# EAGLE design l-drv_h2-smd-001 (EAGLE 7.2.0)
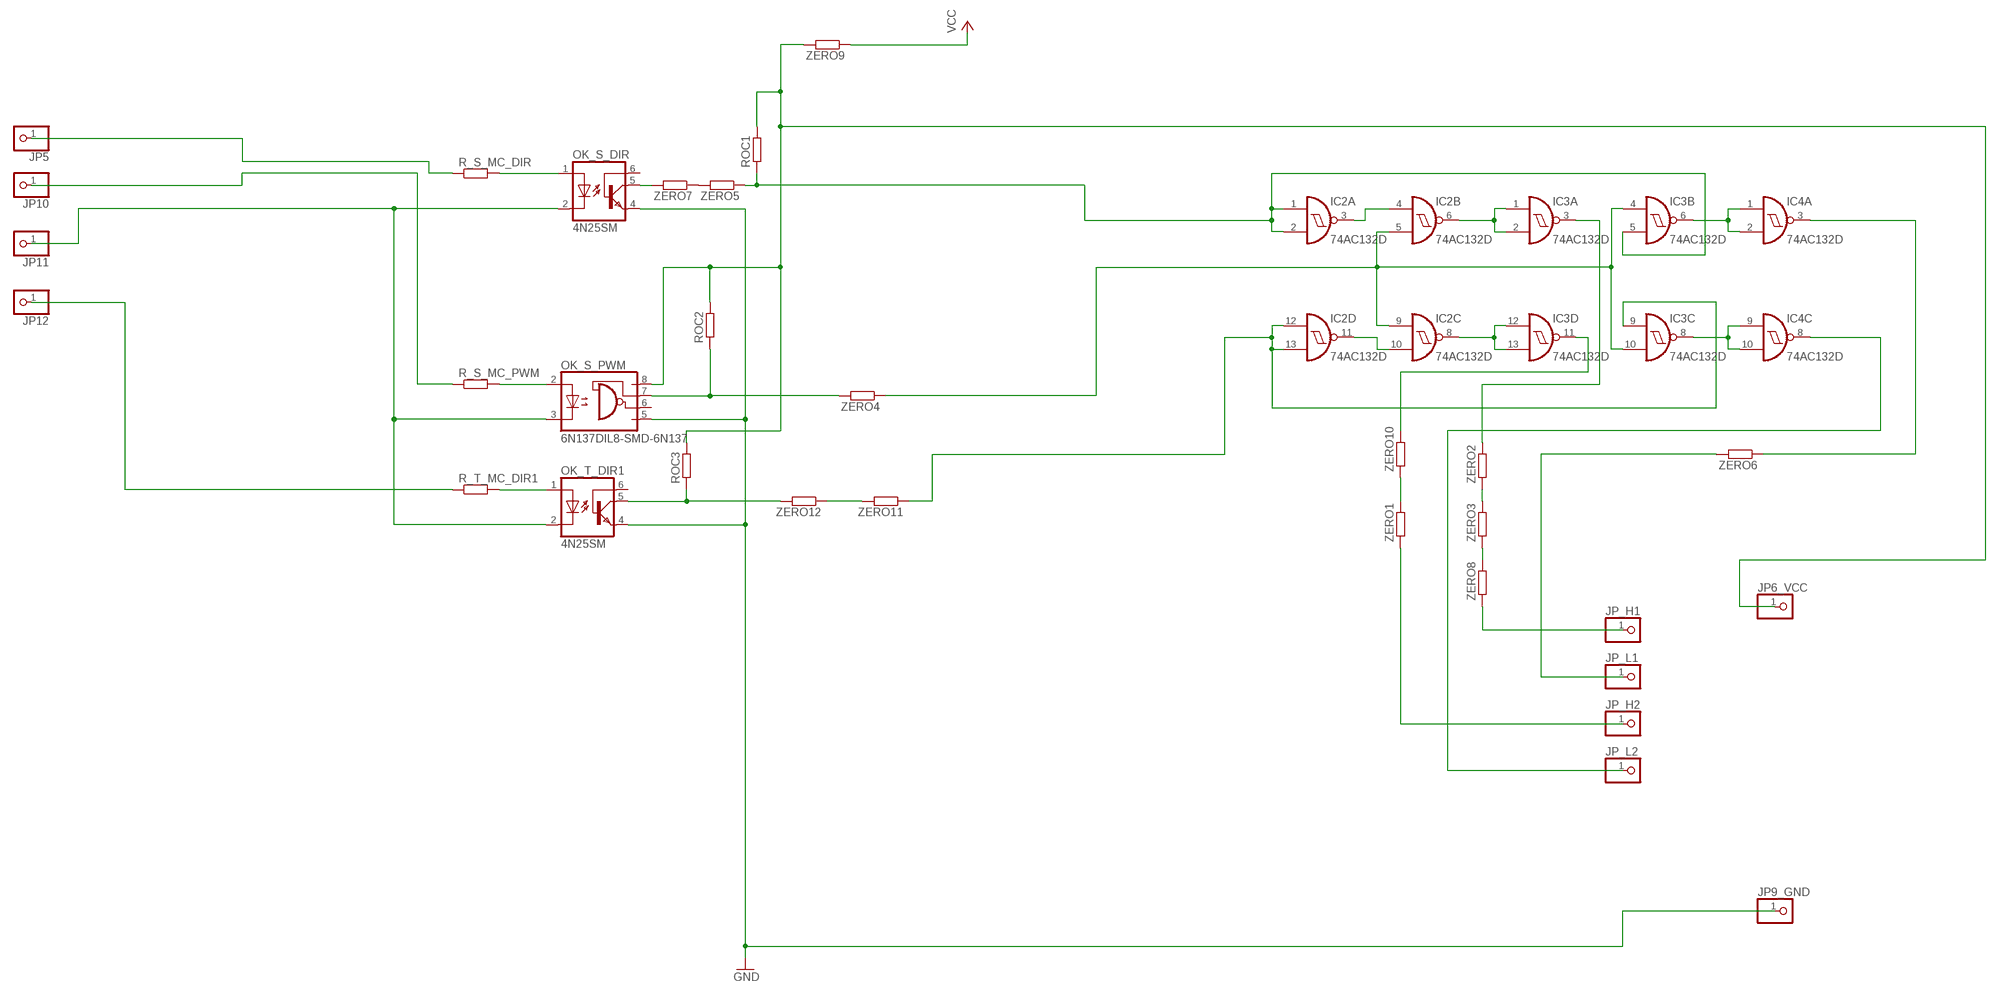
[diagram p0: schematic, sheet 1]

## Parts
IC2  74AC132D  [SO14]
IC3  74AC132D  [SO14]
IC4  74AC132D  [SO14]
JP5  PINHD-1X1  [1X01]
JP6_VCC  PINHD-1X1  [1X01]
JP9_GND  PINHD-1X1  [1X01]
JP10  PINHD-1X1  [1X01]
JP11  PINHD-1X1  [1X01]
JP12  PINHD-1X1  [1X01]
JP_H1  PINHD-1X1  [1X01]
JP_H2  PINHD-1X1  [1X01]
JP_L1  PINHD-1X1  [1X01]
JP_L2  PINHD-1X1  [1X01]
OK_S_DIR  4N25SM  [DIL6-SMD]
OK_S_PWM  6N137DIL8-SMD-6N137  [DIL8-SMD]
OK_T_DIR1  4N25SM  [DIL6-SMD]
R_S_MC_DIR  R-EU_R1206  [R1206]
R_S_MC_PWM  R-EU_R1206  [R1206]
R_T_MC_DIR1  R-EU_R1206  [R1206]
ROC1  R-EU_R1206  [R1206]
ROC2  R-EU_R1206  [R1206]
ROC3  R-EU_R1206  [R1206]
ZERO1  R-EU_R1206  [R1206]
ZERO2  R-EU_R1206  [R1206]
ZERO3  R-EU_R1206  [R1206]
ZERO4  R-EU_R1206  [R1206]
ZERO5  R-EU_R1206  [R1206]
ZERO6  R-EU_R1206  [R1206]
ZERO7  R-EU_R1206  [R1206]
ZERO8  R-EU_R1206  [R1206]
ZERO9  R-EU_R1206  [R1206]
ZERO10  R-EU_R1206  [R1206]
ZERO11  R-EU_R1206  [R1206]
ZERO12  R-EU_R1206  [R1206]

## Nets
GND: JP9_GND.1 OK_S_DIR.4(EMI) OK_S_PWM.5(GND) OK_T_DIR1.4(EMI)
MC_GND: JP11.1 OK_S_DIR.2(C) OK_S_PWM.3(C) OK_T_DIR1.2(C)
N$1: OK_S_DIR.1(A) R_S_MC_DIR.2
N$2: OK_S_PWM.2(A) R_S_MC_PWM.2
N$3: OK_T_DIR1.1(A) R_T_MC_DIR1.2
N$4: IC3.3(A:O) ZERO2.2
N$5: IC2.3(A:O) IC2.4(B:I0)
N$6: JP5.1 R_S_MC_DIR.1
N$7: JP10.1 R_S_MC_PWM.1
N$8: JP12.1 R_T_MC_DIR1.1
N$9: IC2.10(C:I1) IC2.11(D:O)
N$10: ZERO1.2 ZERO10.1
N$11: IC2.6(B:O) IC3.1(A:I0) IC3.2(A:I1)
N$12: IC2.8(C:O) IC3.12(D:I0) IC3.13(D:I1)
N$13: JP_H2.1 ZERO1.1
N$14: JP_H1.1 ZERO8.1
N$15: IC3.11(D:O) ZERO10.2
N$16: ZERO2.1 ZERO3.2
N$17: IC4.3(A:O) ZERO6.1
N$18: IC4.8(C:O) JP_L2.1
N$19: IC3.6(B:O) IC4.1(A:I0) IC4.2(A:I1)
N$20: OK_S_PWM.7(VE) ROC2.1 ZERO4.2
N$21: IC3.8(C:O) IC4.9(C:I0) IC4.10(C:I1)
N$22: ZERO5.2 ZERO7.1
N$23: JP_L1.1 ZERO6.2
N$24: OK_S_DIR.5(COL) ZERO7.2
N$25: ZERO3.1 ZERO8.2
N$26: JP6_VCC.1 OK_S_PWM.8(VCC) ROC1.2 ROC2.2 ROC3.2 ZERO9.2
N$27: OK_T_DIR1.5(COL) ROC3.1 ZERO12.2
N$28: ZERO11.2 ZERO12.1
N$D1: IC2.1(A:I0) IC2.2(A:I1) IC3.5(B:I1) ROC1.1 ZERO5.1
N$D2: IC2.12(D:I0) IC2.13(D:I1) IC3.9(C:I0) ZERO11.1
N$PWM: IC2.5(B:I1) IC2.9(C:I0) IC3.4(B:I0) IC3.10(C:I1) ZERO4.1
VCC: ZERO9.1
Unconnected: IC4.4(B:I0) IC4.5(B:I1) IC4.6(B:O) IC4.11(D:O) IC4.12(D:I0) IC4.13(D:I1) OK_S_DIR.6(BAS) OK_S_PWM.6(VO) OK_T_DIR1.6(BAS)

## Power pins joined to a net without a drawn wire
GND: IC2.7(P:GND) IC3.7(P:GND) IC4.7(P:GND)
VCC: IC2.14(P:VCC) IC3.14(P:VCC) IC4.14(P:VCC)

## Library data of the parts
IC2-IC4 = 74xx-eu:74*132: Quad 2-input NAND schmitt trigger
JP5 JP6_VCC JP9_GND JP10-JP12 JP_H1 JP_H2 JP_L1 JP_L2 = pinhead:PINHD-1X1: PIN HEADER
OK_S_DIR OK_T_DIR1 = optocoupler:4N*?M: General Purpose 6-Pin Phototransistor Optocouplers Source: http://www.fairchildsemi.com/ds/4N/4N35-M.pdf; MF: FAIRCHILD SEMICONDUCTOR; MPN: 4N25SM; OC_FARNELL: 1021152; OC_NEWARK: 34C2020
OK_S_PWM = dbg-misc:6N137: MOTOROLA OPTO COUPLER
R_S_MC_DIR R_S_MC_PWM R_T_MC_DIR1 ROC1-ROC3 ZERO1-ZERO12 = rcl:R-EU_: RESISTOR, European symbol

## Board
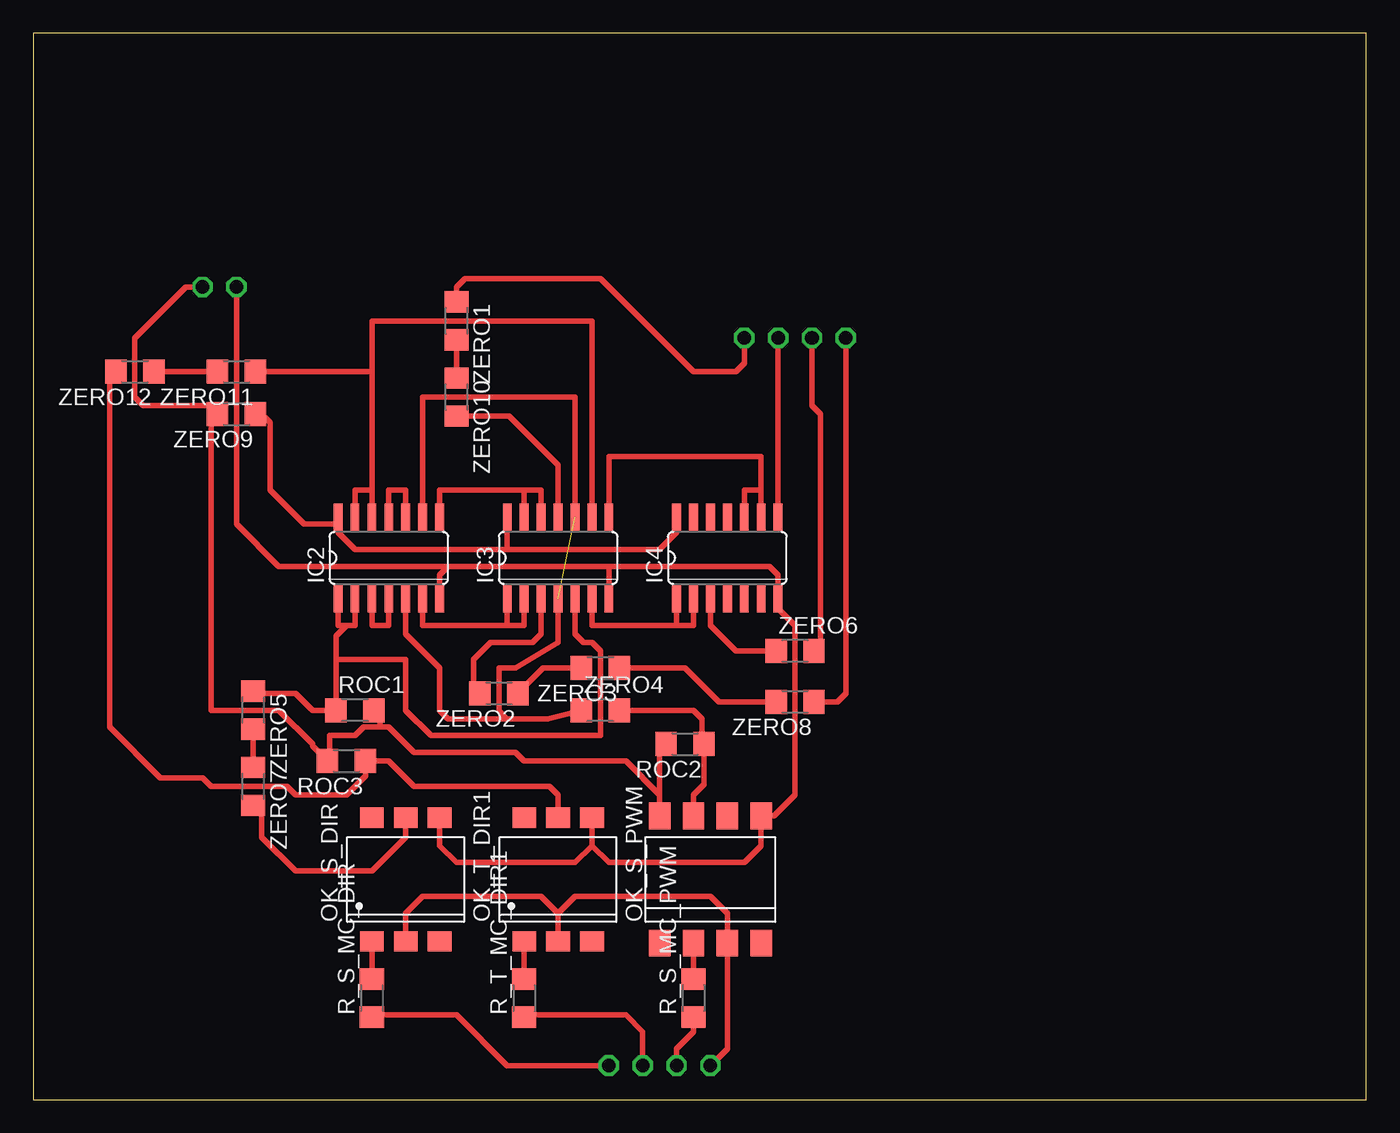
[diagram p1: board, top side]
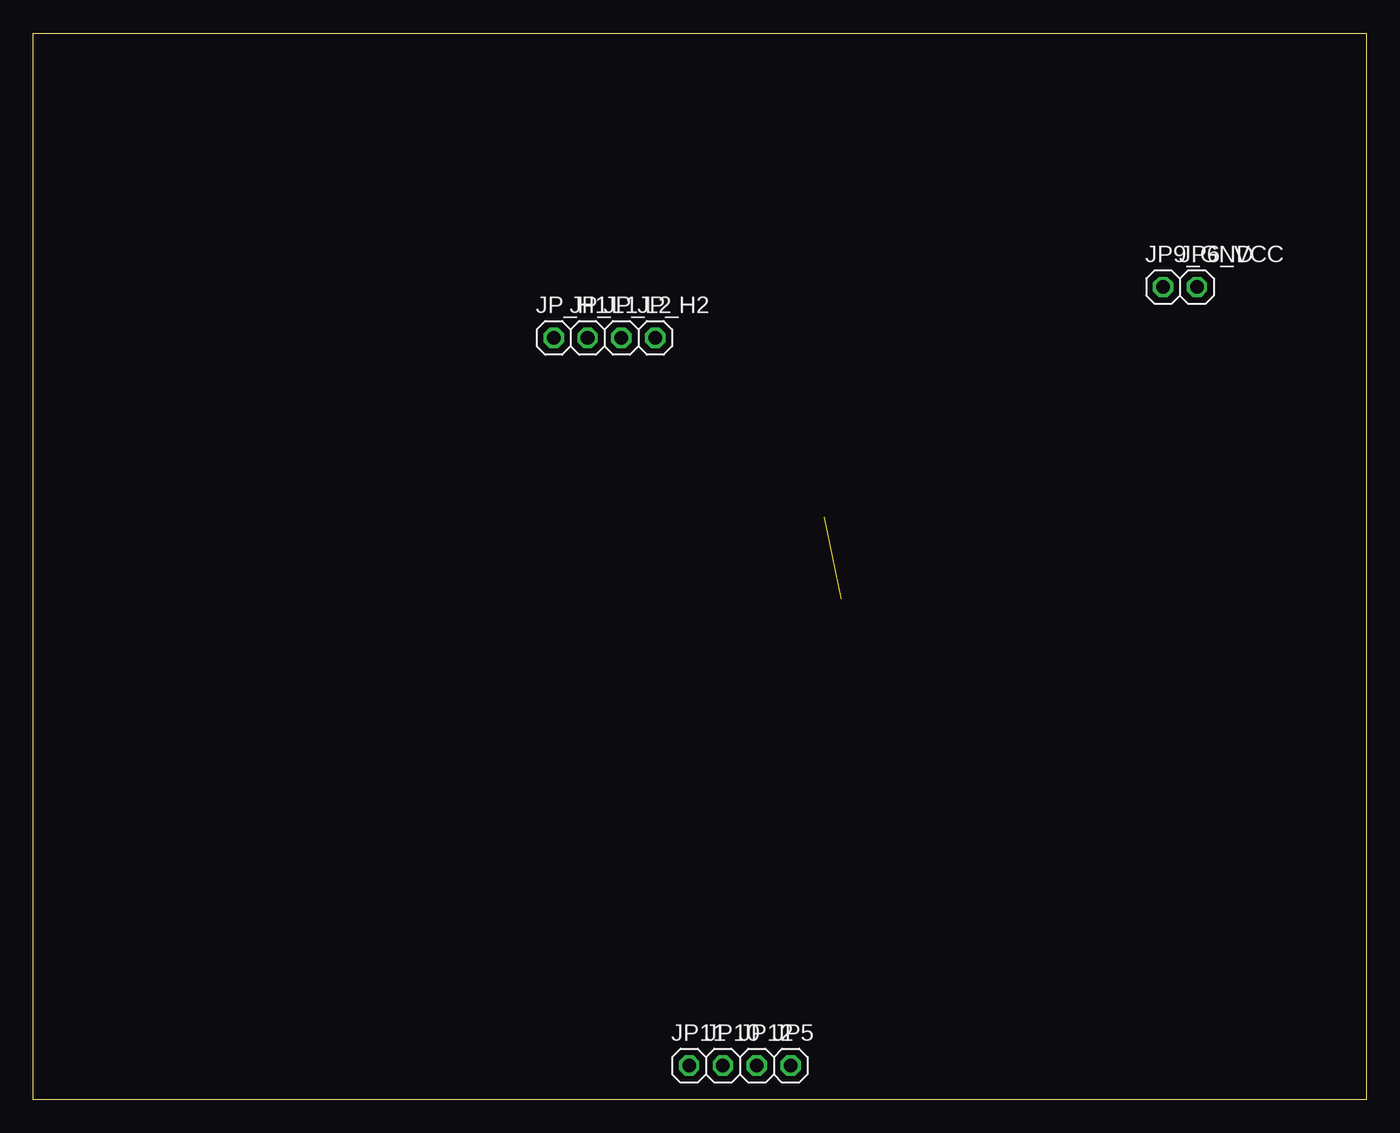
[diagram p2: board, bottom side, seen from below]

Size 100 x 80 mm. Coordinates in mm from the lower left corner, seen from the top.
Outline: 0,0 100,0 100,80 0,80 0,0
Copper layers (1*16): Top 0.035mm / dielectric 1.5mm / Bottom 0.035mm
Design rules "default": minimum track width 10mil, minimum drill 24mil, track to track 8mil, track to pad 8mil, pad to pad 8mil, via to via 8mil, smd to smd 8mil, copper to edge 40mil, drill to drill 8mil, minimum pad ring 10mil, minimum via ring 8mil, stop-mask expansion 4mil, vias tented up to drill 0mil, thermal gap 10mil

### Footprints (pad centres in the part's own frame; a part is rotated, then mirrored left to right if it is on the bottom)
SO14 = smd 0.66 x 2.032: 1 -3.81,-3.073; 2 -2.54,-3.073; 3 -1.27,-3.073; 4 0,-3.073; 5 1.27,-3.073; 6 2.54,-3.073; 7 3.81,-3.073; 8 3.81,3.073; 9 2.54,3.073; 10 1.27,3.073; 11 0,3.073; 12 -1.27,3.073; 13 -2.54,3.073; 14 -3.81,3.073
1X01 = drill 1.016 octagon: 1 0,0
DIL6-SMD = smd 1.78 x 1.52: 1 -2.54,-4.645; 2 0,-4.645; 3 2.54,-4.645; 4 2.54,4.645; 5 0,4.645; 6 -2.54,4.645
DIL8-SMD = smd 1.6 x 2: 1 -3.81,-4.77; 2 -1.27,-4.77; 3 1.27,-4.77; 4 3.81,-4.77; 5 3.81,4.77; 6 1.27,4.77; 7 -1.27,4.77; 8 -3.81,4.77
R1206 = smd 1.6 x 1.803: 1 -1.422,0; 2 1.422,0

### Placement (x,y rotation side)
IC2  26.67,40.64 0 top
IC3  39.37,40.64 0 top
IC4  52.07,40.64 0 top
JP5  43.18,2.54 0 bottom
JP6_VCC  12.7,60.96 0 bottom
JP9_GND  15.24,60.96 0 bottom
JP10  48.26,2.54 0 bottom
JP11  50.8,2.54 0 bottom
JP12  45.72,2.54 0 bottom
JP_H1  60.96,57.15 0 bottom
JP_H2  53.34,57.15 0 bottom
JP_L1  58.42,57.15 0 bottom
JP_L2  55.88,57.15 0 bottom
OK_S_DIR  27.94,16.51 0 top
OK_S_PWM  50.8,16.51 0 top
OK_T_DIR1  39.37,16.51 0 top
R_S_MC_DIR  25.4,7.62 90 top
R_S_MC_PWM  49.53,7.62 90 top
R_T_MC_DIR1  36.83,7.62 90 top
ROC1  24.13,29.21 0 top
ROC2  48.9,26.67 180 top
ROC3  23.5,25.4 180 top
ZERO1  31.75,58.42 270 top
ZERO2  34.92,30.48 180 top
ZERO3  42.55,32.38 180 top
ZERO4  42.55,29.21 0 top
ZERO5  16.51,29.21 270 top
ZERO6  57.15,33.66 0 top
ZERO7  16.51,23.5 270 top
ZERO8  57.15,29.84 180 top
ZERO9  15.24,51.44 180 top
ZERO10  31.75,52.7 270 top
ZERO11  15.24,54.61 180 top
ZERO12  7.62,54.61 180 top

### Tracks (layer width: path | path; a pad name or v marks a point on that pad's centre or on a via)
GND
  Top 0.406: OK_S_DIR.4 30.48,19.05 31.75,17.78 40.64,17.78 41.91,19.05 | OK_T_DIR1.4 41.91,19.05 | 41.91,19.05 43.18,17.78 53.34,17.78 54.61,19.05 OK_S_PWM.5 55.57,21.28 57.15,22.86 57.15,35.56 55.88,36.83 IC4.7 55.88,39.37 55.24,40.01 43.18,40.01 | IC2.7 30.48,39.37 31.11,40.01 | 31.11,40.01 43.18,40.01 | IC3.7 43.18,40.01 | JP9_GND.1 15.24,43.18 18.41,40.01 31.11,40.01
MC_GND
  Top 0.406: 39.37,13.97 40.64,15.24 50.8,15.24 52.07,13.97 OK_S_PWM.3 52.07,3.81 JP11.1 | OK_T_DIR1.2 39.37,13.97 | 39.37,13.97 38.1,15.24 29.21,15.24 27.94,13.97 OK_S_DIR.2
N$1
  Top 0.406: OK_S_DIR.1 R_S_MC_DIR.2
N$2
  Top 0.406: OK_S_PWM.2 R_S_MC_PWM.2
N$3
  Top 0.406: OK_T_DIR1.1 R_T_MC_DIR1.2
N$4
  Top 0.406: IC3.3 38.1,34.92 37.47,34.29 34.29,34.29 33.02,33.02 33.02,30.96 ZERO2.2
N$5
  Top 0.406: IC2.3 25.4,35.56 26.67,35.56 IC2.4
N$6
  Top 0.406: JP5.1 35.56,2.54 31.75,6.35 25.55,6.35 R_S_MC_DIR.1
N$7
  Top 0.406: R_S_MC_PWM.1 49.53,5.08 48.26,3.81 JP10.1
N$8
  Top 0.406: JP12.1 45.72,5.08 44.45,6.35 36.98,6.35 R_T_MC_DIR1.1
N$9
  Top 0.406: IC2.10 27.94,45.72 26.67,45.72 IC2.11
N$10
  Top 0.406: ZERO1.2 ZERO10.1
N$11
  Top 0.406: IC2.6 29.21,35.56 35.56,35.56 | 35.56,35.56 36.83,35.56 IC3.2 | IC3.1 35.56,35.56
N$12
  Top 0.406: IC3.13 36.83,45.72 | 36.83,45.72 38.1,45.72 IC3.12 | IC2.8 30.48,45.72 36.83,45.72
N$13
  Top 0.406: ZERO1.1 31.75,60.96 32.38,61.59 42.55,61.59 49.53,54.61 52.7,54.61 53.34,55.24 JP_H2.1
N$14
  Top 0.406: JP_H1.1 60.96,30.48 60.33,29.84 ZERO8.1
N$15
  Top 0.406: ZERO10.2 35.71,51.28 39.37,47.62 IC3.11
N$16
  Top 0.406: ZERO3.2 38.25,32.38 ZERO2.1
N$17
  Top 0.406: IC4.3 50.8,35.56 52.7,33.66 ZERO6.1
N$18
  Top 0.406: JP_L2.1 IC4.8
N$19
  Top 0.406: IC3.6 41.91,35.56 48.26,35.56 | 48.26,35.56 IC4.1 | IC4.2 49.53,35.56 48.26,35.56
N$20
  Top 0.406: OK_S_PWM.7 49.53,22.86 50.32,23.65 ROC2.1 50.32,27.15 50.16,27.3 50.16,28.57 49.53,29.21 ZERO4.2
N$21
  Top 0.406: IC3.8 43.18,48.26 54.61,48.26 54.61,45.72 | 54.61,45.72 IC4.9 | IC4.10 53.34,45.72 54.61,45.72
N$22
  Top 0.406: ZERO7.1 ZERO5.2
N$23
  Top 0.406: ZERO6.2 59.05,34.14 59.05,51.44 58.42,52.07 JP_L1.1
N$24
  Top 0.406: OK_S_DIR.5 27.94,19.68 25.4,17.14 19.68,17.14 17.14,19.68 17.14,21.44 ZERO7.2
N$25
  Top 0.406: ZERO3.1 48.9,32.38 51.44,29.84 ZERO8.2
N$26
  Top 0.406: ROC2.2 46.99,26.19 OK_S_PWM.8 46.99,22.86 44.45,25.4 36.83,25.4 36.2,26.04 28.57,26.04 26.67,27.94 26.04,27.94 | 26.04,27.94 26.04,28.73 ROC1.2 | JP6_VCC.1 11.43,60.96 7.62,57.15 7.62,52.7 8.26,52.07 13.18,52.07 ZERO9.2 13.34,50.95 13.34,29.21 18.41,29.21 20.95,26.67 20.95,26.52 ROC3.2 22.23,25.55 22.23,27.3 24.13,27.3 24.77,27.94 26.04,27.94
N$27
  Top 0.406: OK_T_DIR1.5 39.37,22.86 38.73,23.5 28.57,23.5 26.67,25.4 ROC3.1 24.92,24.28 23.5,22.86 19.68,22.86 19.05,23.5 13.34,23.5 12.7,24.13 9.53,24.13 5.71,27.94 5.71,54.13 ZERO12.2
N$28
  Top 0.406: ZERO12.1 ZERO11.2
N$D1
  Top 0.406: IC2.1 22.86,35.56 23.5,35.56 | 23.5,35.56 24.13,35.56 IC2.2 | ROC1.1 22.71,33.02 | 22.71,33.02 22.71,34.77 23.5,35.56 | ROC1.1 22.71,28.73 | 22.71,33.02 27.94,33.02 27.94,29.21 29.84,27.3 42.55,27.3 42.55,33.66 41.91,34.29 41.27,34.29 40.64,34.92 IC3.5 | 22.86,29.06 ROC1.1 | ROC1.1 20.95,29.21 19.68,30.48 16.66,30.48 ZERO5.1
N$D2
  Top 0.406: IC2.13 24.13,45.72 25.4,45.72 | 25.4,45.72 IC2.12 | IC3.9 41.91,58.42 25.4,58.42 25.4,54.61 | 25.4,54.61 25.4,45.72 | ZERO11.1 25.4,54.61
N$PWM  (1 unrouted)
  Top 0.406: IC2.9 29.21,52.7 40.64,52.7 IC3.10 | IC3.4 39.37,34.29 36.2,32.38 34.92,32.38 34.92,29.21 35.56,28.57 | 35.56,28.57 38.58,28.57 ZERO4.1 | IC2.5 27.94,34.92 30.48,32.38 30.48,29.21 31.11,28.57 35.56,28.57
VCC
  Top 0.406: IC2.14 22.86,43.18 | 22.86,43.18 22.86,42.55 24.13,41.27 35.56,41.27 | 35.56,41.27 IC3.14 | 35.56,41.27 46.99,41.27 48.26,42.55 IC4.14 | 22.86,43.18 20.32,43.18 17.78,45.72 17.78,50.8 17.14,51.44 ZERO9.1